# EAGLE design k1fm-pico-balloon (EAGLE 9.4.1)
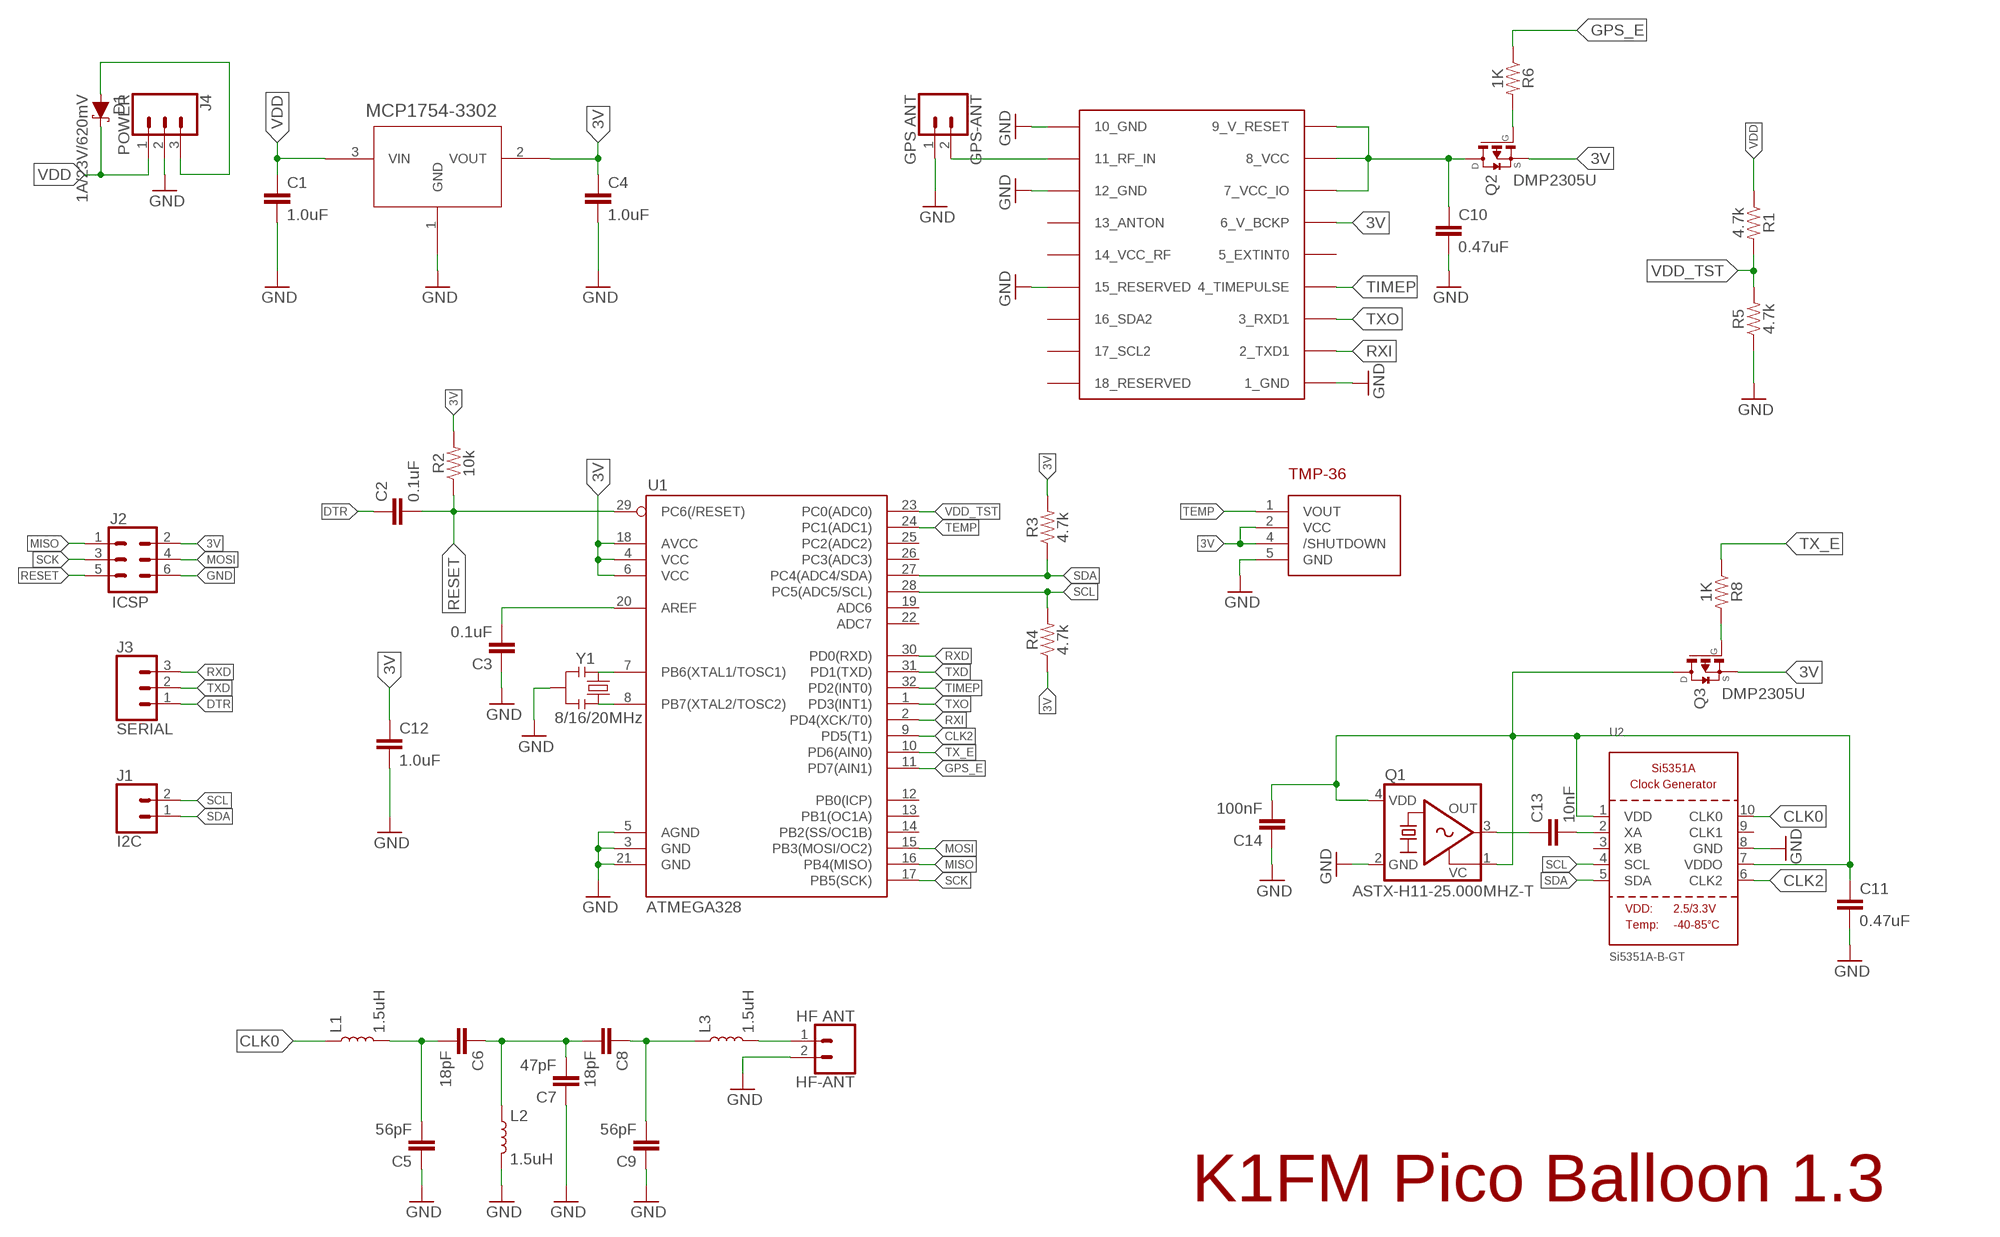
[diagram p0: schematic, sheet 1]

## Parts
C1  1.0uF  1.0UF-0603-16V-10%  [0603]
C2  0.1uF  0.1UF-0603-25V-5%  [0603]
C3  0.1uF  0.1UF-0603-25V-5%  [0603]
C4  1.0uF  1.0UF-0603-16V-10%  [0603]
C5  56pF  0.1UF-0603-25V-5%  [0603]
C6  18pF  0.1UF-0603-25V-5%  [0603]
C7  47pF  0.1UF-0603-25V-5%  [0603]
C8  18pF  0.1UF-0603-25V-5%  [0603]
C9  56pF  0.1UF-0603-25V-5%  [0603]
C10  0.47uF  0.1UF-0603-25V-5%  [0603]
C11  0.47uF  0.1UF-0603-25V-5%  [0603]
C12  1.0uF  1.0UF-0603-16V-10%  [0603]
C13  10nF  10NF-0603-50V-10%  [0603]
C14  100nF  10NF-0603-50V-10%  [0603]
D1  1A/23V/620mV  DIODE-SCHOTTKY-BAT20J  [SOD-323]
GPS1  UBLOX_MAX  [UBLOX_MAX]
GPS-ANT  GPS ANT  CONN_02  [1X02]
HF-ANT  HF ANT  CONN_02  [1X02]
J1  I2C  CONN_02  [1X02]
J2  ICSP  CONN_03X2FEMALE  [2X3]
J3  SERIAL  CONN_03  [1X03]
J4  POWER  CONN_03  [1X03]
L1  1.5uH  INDUCTOR-0603-33NH  [0603]
L2  1.5uH  INDUCTOR-0603-33NH  [0603]
L3  1.5uH  INDUCTOR-0603-33NH  [0603]
Q1  ASTX-H11-25.000MHZ-T  KXO-VCXO-SINE-84  [3.2X2.5_KXO-84]
Q2  DMP2305U  [SOT23]
Q3  DMP2305U  [SOT23]
R1  4.7k  10KOHM-0603-1/10W-1%  [0603]
R2  10k  10KOHM-0603-1/10W-1%  [0603]
R3  4.7k  4.7KOHM-0603-1/10W-1%  [0603]
R4  4.7k  4.7KOHM-0603-1/10W-1%  [0603]
R5  4.7k  10KOHM-0603-1/10W-1%  [0603]
R6  1K  10KOHM-0603-1/10W-1%  [0603]
R8  1K  10KOHM-0603-1/10W-1%  [0603]
U1  ATMEGA328  ATMEGA168  [TQFP32-08]
U2  Si5351A-B-GT  SI5351A  [MSOP10]
U3  MCP1754X-XXXXX/C  [SOT-23A_MC]
U4  TMP36  [SOT-23]
Y1  8/16/20MHz  RESONATOR1:1  [RESONATOR-SMD-1:1]

## Nets
3V: C4.1 C12.1 GPS1.6_V_BCKP J2.2 Q2.2(S) Q3.2(S) R2.2 R3.2 R4.1 U1.4(VCC) U1.6(VCC) U1.18(AVCC) U3.2(VOUT) U4.2(VCC) U4.4(/SHUTDOWN)
ANT: HF-ANT.1 L3.2
AREF: C3.2 U1.20(AREF)
CLK0: L1.1 U2.10(CLK0)
CLK2: U1.9(PD5(T1)) U2.6(CLK2)
DTR: C2.1 J3.1
GND: C1.2 C3.1 C4.2 C5.1 C7.1 C9.1 C10.2 C11.2 C12.2 C14.1 GPS1.1_GND GPS1.10_GND GPS1.12_GND GPS1.15_RESERVED GPS-ANT.1 HF-ANT.2 J2.6 J4.2 L2.2 Q1.2(GND) R5.1 U1.3(GND) U1.5(AGND) U1.21(GND) U2.8(GND) U3.1(GND) U4.5(GND) Y1.2
GPS_E: R6.1 U1.11(PD7(AIN1))
MISO: J2.1 U1.16(PB4(MISO))
MOSI: J2.4 U1.15(PB3(MOSI/OC2))
N$1: C13.1 Q1.3(OUT)
N$2: C13.2 U2.2(XA)
N$3: D1.A J4.3
N$5: Q2.1(G) R6.2
N$6: GPS1.11_RF_IN GPS-ANT.2
N$7: Q3.1(G) R8.2
N$8: C10.1 GPS1.7_VCC_IO GPS1.8_VCC GPS1.9_V_RESET Q2.3(D)
N$9: C6.1 C7.2 C8.2 L2.1
N$12: C5.2 C6.2 L1.2
N$13: C8.1 C9.2 L3.1
N$15: C11.1 C14.2 Q1.1(VC) Q1.4(VDD) Q3.3(D) U2.1(VDD) U2.7(VDDO)
N$28: U1.8(PB7(XTAL2/TOSC2)) Y1.3
N$29: U1.7(PB6(XTAL1/TOSC1)) Y1.1
RESET: C2.2 J2.5 R2.1 U1.29(PC6(/RESET))
RXD: J3.3 U1.30(PD0(RXD))
RXI: GPS1.2_TXD1 U1.2(PD4(XCK/T0))
SCK: J2.3 U1.17(PB5(SCK))
SCL: J1.2 R4.2 U1.28(PC5(ADC5/SCL)) U2.4(SCL)
SDA: J1.1 R3.1 U1.27(PC4(ADC4/SDA)) U2.5(SDA)
TEMP: U1.24(PC1(ADC1)) U4.1(VOUT)
TIMEP: GPS1.4_TIMEPULSE U1.32(PD2(INT0))
TX_E: R8.1 U1.10(PD6(AIN0))
TXD: J3.2 U1.31(PD1(TXD))
TXO: GPS1.3_RXD1 U1.1(PD3(INT1))
VDD: C1.1 D1.C J4.1 R1.1 U3.3(VIN)
VDD_TST: R1.2 R5.2 U1.23(PC0(ADC0))
Unconnected: GPS1.5_EXTINT0 GPS1.13_ANTON GPS1.14_VCC_RF GPS1.16_SDA2 GPS1.17_SCL2 GPS1.18_RESERVED U1.12(PB0(ICP)) U1.13(PB1(OC1A)) U1.14(PB2(SS/OC1B)) U1.19(ADC6) U1.22(ADC7) U1.25(PC2(ADC2)) U1.26(PC3(ADC3)) U2.3(XB) U2.9(CLK1)

## Notes on the sheet
- K1FM Pico Balloon 1.3

## Library data of the parts
C1 C4 C12 = SparkFun-Capacitors:1.0UF: 1µF ceramic capacitors A capacitor is a passive two-terminal electrical component used to store electrical energy temporarily in an electric field.; PROD_ID: CAP-00868
C2 C3 = SparkFun-Capacitors:0.1UF: 0.1µF ceramic capacitors A capacitor is a passive two-terminal electrical component used to store electrical energy temporarily in an electric field.; PROD_ID: CAP-08604
C5-C11 = SparkFun-Capacitors:0.1UF: 0.1µF ceramic capacitors A capacitor is a passive two-terminal electrical component used to store electrical energy temporarily in an electric field.; PROD_ID: CAP-08604; VALUE: 0.1uF
C13 = SparkFun-Capacitors:10NF: 0.01uF/10nF/10,000pF ceramic capacitors A capacitor is a passive two-terminal electrical component used to store electrical energy temporarily in an electric field. CAP-09321; PROD_ID: CAP-00867
C14 = SparkFun-Capacitors:10NF: 0.01uF/10nF/10,000pF ceramic capacitors A capacitor is a passive two-terminal electrical component used to store electrical energy temporarily in an electric field. CAP-09321; PROD_ID: CAP-00867; VALUE: 10nF
D1 = SparkFun-DiscreteSemi:DIODE-SCHOTTKY: Schottky diode A Schottky diode is a semiconductor diode which has a low forward voltage drop and a very fast switching action.; PROD_ID: DIO-11623
GPS1 = Ava:UBLOX_MAX: UBLOX MAX
GPS-ANT HF-ANT J1 = SparkFun-Connectors:CONN_02: Multi connection point. Often used as Generic Header-pin footprint for 0.1 inch spaced/style header connections On any of the 0.1 inch spaced packages, you can populate with these: Break Away Headers - Straight <https://www.sparkfun.com/products/116> (PRT-00116) Break Away Male Headers - Right Angle <https://www.sparkfun.com/products/553> (PRT-00553) Female Headers <https://www.sparkfun.com/products/115> (PRT-00115) Break Away Headers - Machine Pin <https://www.sparkfun.com/products/117> (PRT-00117) Break Away Female Headers - Swiss Machine Pin <https://www.sparkfun.com/products/743> (PRT-00743) For SCREWTERMINALS and SPRING TERMINALS visit here: Screw Terimnals on SparkFun.com <https://www.sparkfun.com/search/results?term=Screw+Terminals> (5mm/3.5mm/2.54mm spacing) This device is also useful as a general connection point to wire up your design to another part of your project. Our various solder wires solder well into these plated through hole pads. Hook-Up Wire - Assortment (Stranded, 22 AWG) <https://www.sparkfun.com/products/11375> (PRT-11375) Hook-Up Wire - Assortment (Solid Core, 22 AWG) <https://www.sparkfun.com/products/11367> (PRT-11367) View the entire wire category on our website here <https://www.sparkfun.com/categories/141> Special notes: Molex polarized connector foot print use with: PRT-08233 with associated crimp pins and housings. 2.54_SCREWTERM for use with PRT-10571. 3.5mm Screw Terminal footprints for PRT-08084 5mm Screw Terminal footprints for use with PRT-08432
J2 = SparkFun-Connectors:CONN_03X2: Multi connection point. Often used as Generic Header-pin footprint for 0.1 inch spaced/style header connections You can populate with any combo of single row headers, but if you'd like an exact match, check these: Header - 2x3 (Male, 0.1") <https://www.sparkfun.com/products/12807> (PRT-12807) Header - 2x3 (Female, 0.1") <https://www.sparkfun.com/products/13010> (PRT-13010) 2x3 Pin Shrouded Header <https://www.sparkfun.com/products/10877> (PRT-10877) On any of the 0.1 inch spaced packages, you can populate with these: Break Away Headers - Straight <https://www.sparkfun.com/products/116> (PRT-00116) Break Away Male Headers - Right Angle <https://www.sparkfun.com/products/553> (PRT-00553) Female Headers <https://www.sparkfun.com/products/115> (PRT-00115) Break Away Headers - Machine Pin <https://www.sparkfun.com/products/117> (PRT-00117) Break Away Female Headers - Swiss Machine Pin <https://www.sparkfun.com/products/743> (PRT-00743) Special note: the shrouded connector mates well with our 3x2 ribbon cables: Ribbon Crimp Connector - 6-pin (2x3, Female) <https://www.sparkfun.com/products/10651> (PRT-10651) Ribbon Cable - 6 wire (15ft) <https://www.sparkfun.com/products/10646> (PRT-10646); PROD_ID: CONN-11566; VALUE: FEMALE 2x3
J3 J4 = SparkFun-Connectors:CONN_03: Multi connection point. Often used as Generic Header-pin footprint for 0.1 inch spaced/style header connections On any of the 0.1 inch spaced packages, you can populate with these: Break Away Headers - Straight <https://www.sparkfun.com/products/116> (PRT-00116) Break Away Male Headers - Right Angle <https://www.sparkfun.com/products/553> (PRT-00553) Female Headers <https://www.sparkfun.com/products/115> (PRT-00115) Break Away Headers - Machine Pin <https://www.sparkfun.com/products/117> (PRT-00117) Break Away Female Headers - Swiss Machine Pin <https://www.sparkfun.com/products/743> (PRT-00743) Stackable Header - 3 Pin (Female, 0.1") <https://www.sparkfun.com/products/13875> (PRT-13875) For SCREWTERMINALS and SPRING TERMINALS visit here: Screw Terimnals on SparkFun.com <https://www.sparkfun.com/search/results?term=Screw+Terminals> (5mm/3.5mm/2.54mm spacing) This device is also useful as a general connection point to wire up your design to another part of your project. Our various solder wires solder well into these plated through hole pads. Hook-Up Wire - Assortment (Stranded, 22 AWG) <https://www.sparkfun.com/products/11375> (PRT-11375) Hook-Up Wire - Assortment (Solid Core, 22 AWG) <https://www.sparkfun.com/products/11367> (PRT-11367) View the entire wire category on our website here <https://www.sparkfun.com/categories/141> Special notes: Molex polarized connector foot print use with SKU : PRT-08232 with associated crimp pins and housings.
L1-L3 = SparkFun-Coils:INDUCTOR: Inductors Resist changes in electrical current. Basically a coil of wire. SparkFun Products: SparkFun Load Cell Amplifier - HX711 <https://www.sparkfun.com/products/13879> IOIO-OTG - V2.2 <https://www.sparkfun.com/products/13613>; PROD_ID: NDUC-07874; VALUE: 33nH/±5%/500mA
Q1 = crystal-geyer_V1_0:KXO-VCXO-SINE: VCXO : Sinewave - Serie Model Size l/w/h [mm] Frequency Range Frequency Stability Temp. Range [°C] Output AECQ 200 availabel Datasheet KXO-81 KXO-86 KXO-84 KXO-83 KXO-82 2.0/1.6/0.7 2.5/2.0/0.7 3.2/2.5/1.0 5.0/3.2/1.5 7.0/5.0/2.0 13,0 ~ 40,0 MHz 13,0 ~ 40,0 MHz 10,0 ~ 26,0 MHz 12,0 ~ 26,0 MHz 12,6 ~ 20,0 MHz ±10 … ±50ppm ±10 … ±50ppm ±10 … ±50ppm ±10 … ±50ppm ±10 … ±50ppm (*) -30°C …+75°C (*) -30°C …+75°C (*) -40°C …+85°C (*) -40°C …+85°C (*) -30°C …+80°C Sinewave Sinewave Sinewave Sinewave Sinewave - - - - - KXO-81.pdf <http://www.geyer-electronic.de/uploads/tx_userartikelfrequenz/GEYER-KXO-81-VCXO-sinewave.pdf> KXO-86.pdf <http://www.geyer-electronic.de/uploads/tx_userartikelfrequenz/GEYER-KXO-86-VCXO-sinewave.pdf> KXO-84.pdf <http://www.geyer-electronic.de/uploads/tx_userartikelfrequenz/GEYER-KXO-84-VCXO-sinewave.pdf> KXO-83.pdf <http://www.geyer-electronic.de/uploads/tx_userartikelfrequenz/GEYER-KXO-83-VCXO-sinewave.pdf> KXO-82.pdf <http://www.geyer-electronic.de/uploads/tx_userartikelfrequenz/GEYER-KXO-82-VCXO-sinewave.pdf> <http://www.geyer-electronic.de/fileadmin/template/img/logo-geyer-electronic.png> Details see: http://www.geyer-electronic.de/Frequenz-Produkte.9.0.html Created 2016-06-07, Hans Locher 2016 (C) Geyer Quartz Technology KXO81,KXO86,KXO84,KXO83,KXO82,2,0x1,6;2.0x1.6;2,5x2,0;2.5x2.0;3,2x2,5;3.2x2.5;5,0x3,2;5.0x3.2;7,0x5,0;7.0x5.0;2016;2520;3225;5032;7050
Q2 Q3 = transistor-fet:DMP2305U: P-Channel Enhancement MOSFET
R1 R5 R6 R8 = SparkFun-Resistors:10KOHM: 10kΩ resistor A resistor is a passive two-terminal electrical component that implements electrical resistance as a circuit element. Resistors act to reduce current flow, and, at the same time, act to lower voltage levels within circuits. - Wikipedia; PROD_ID: RES-00824; VALUE: 10k
R2 = SparkFun-Resistors:10KOHM: 10kΩ resistor A resistor is a passive two-terminal electrical component that implements electrical resistance as a circuit element. Resistors act to reduce current flow, and, at the same time, act to lower voltage levels within circuits. - Wikipedia; PROD_ID: RES-00824
R3 R4 = SparkFun-Resistors:4.7KOHM: 4.7kΩ resistor A resistor is a passive two-terminal electrical component that implements electrical resistance as a circuit element. Resistors act to reduce current flow, and, at the same time, act to lower voltage levels within circuits. - Wikipedia; PROD_ID: RES-07857
U1 = SparkFun:ATMEGA168
U2 = microbuilder:SI5351A: Si5351A 8kHz-160MHz I2C Clock Generator VDD: 2.5V or 3.3V Input Range: 25MHz or 27MHz XTAL User selectable internal input load capacitors: 6, 8 or 10 pF Output Impedance: 85 Ohm Output Load Capacitance: 5-15pF Operating Temperature: -40°C - 85°C Operating Current (3 outputs): 35mA Output buffer voltage (VDDO): 1.8, 2.5 or 3.3V Note: If VDDO is not used it should be connected to VDD. Unused clock out pins should be left floating.
U3 = MCP1754:MCP1754X-XXXXX/C
U4 = TMP36:TMP36
Y1 = Testing:RESONATOR: Resonator Small SMD resonator. This is the itty bitty 10/20MHz resonators with built in caps. CSTCE10M0G55 and CSTCE20M0V53. Footprint for SMD has been used in SFE production for years, and does work okay. 1:1 is an attempt to get larger fillets on the sides so it will be easier to inspect these solders in our AOI machine. The pads have been minimized to match the actual metal under the resonator. To see this relation, it includes an image import of the bottom side of the component. Imported to scale on layer 200.

## Net classes
1 vcc: width 0.254 mm

## Board
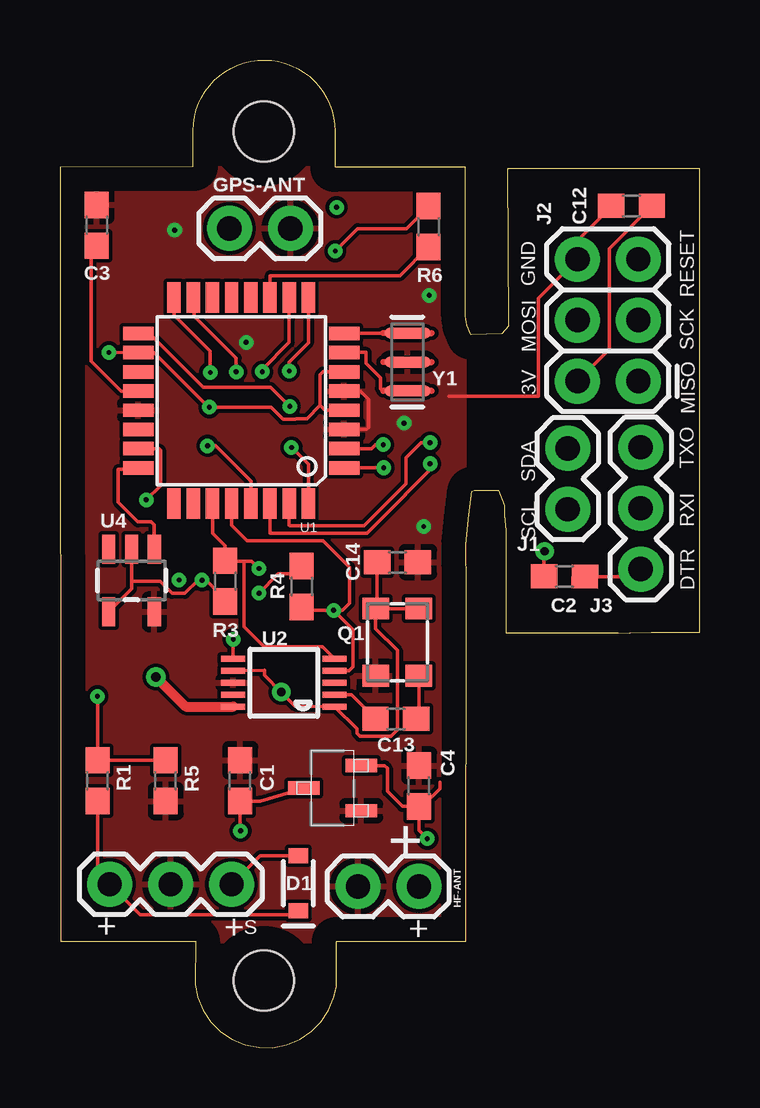
[diagram p1: board, top side]
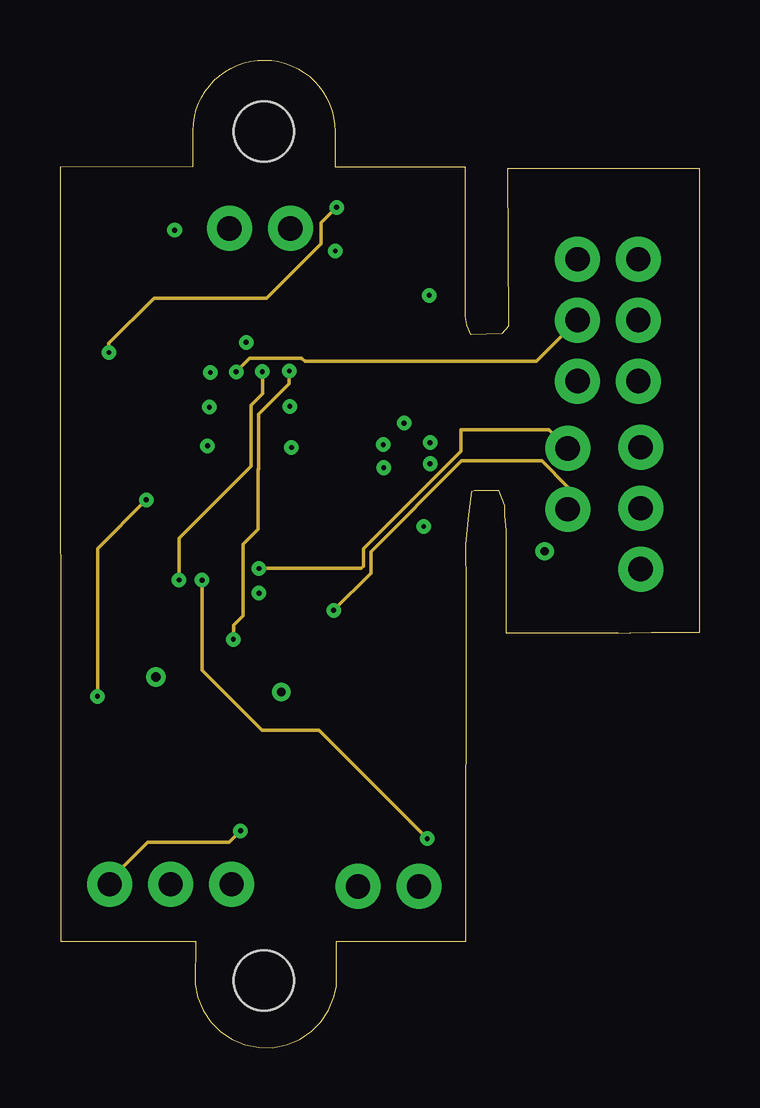
[diagram p2: board, inner layer Route2]
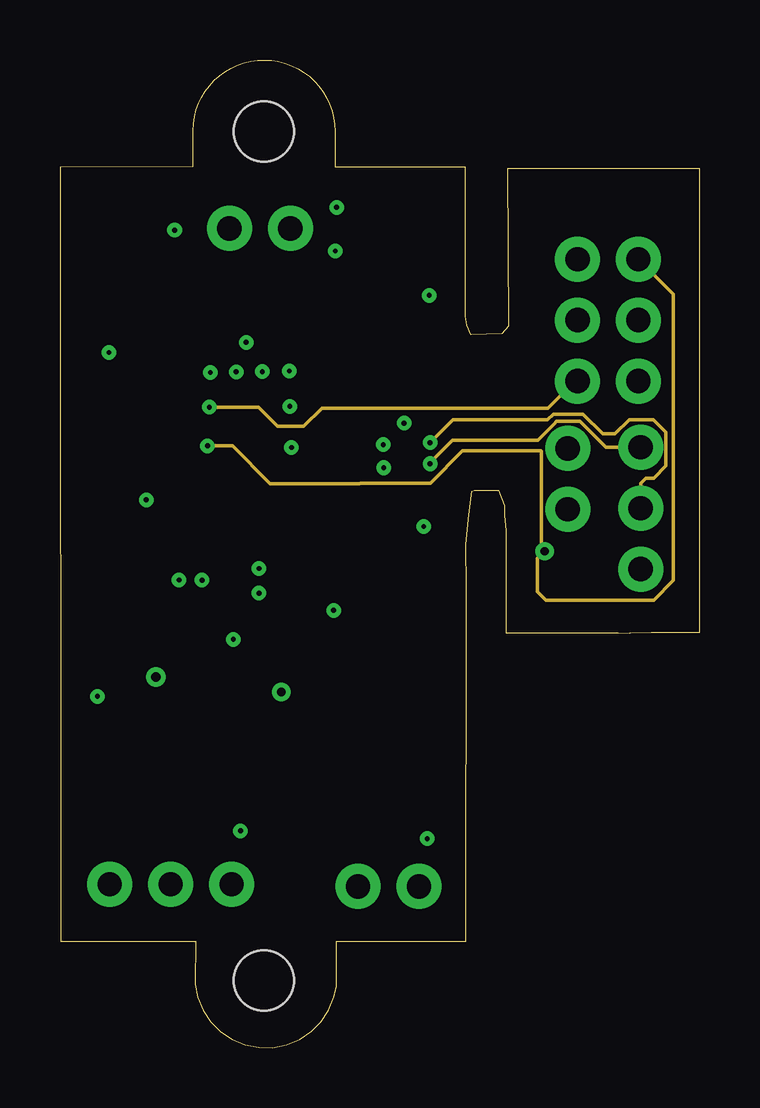
[diagram p3: board, inner layer Route15]
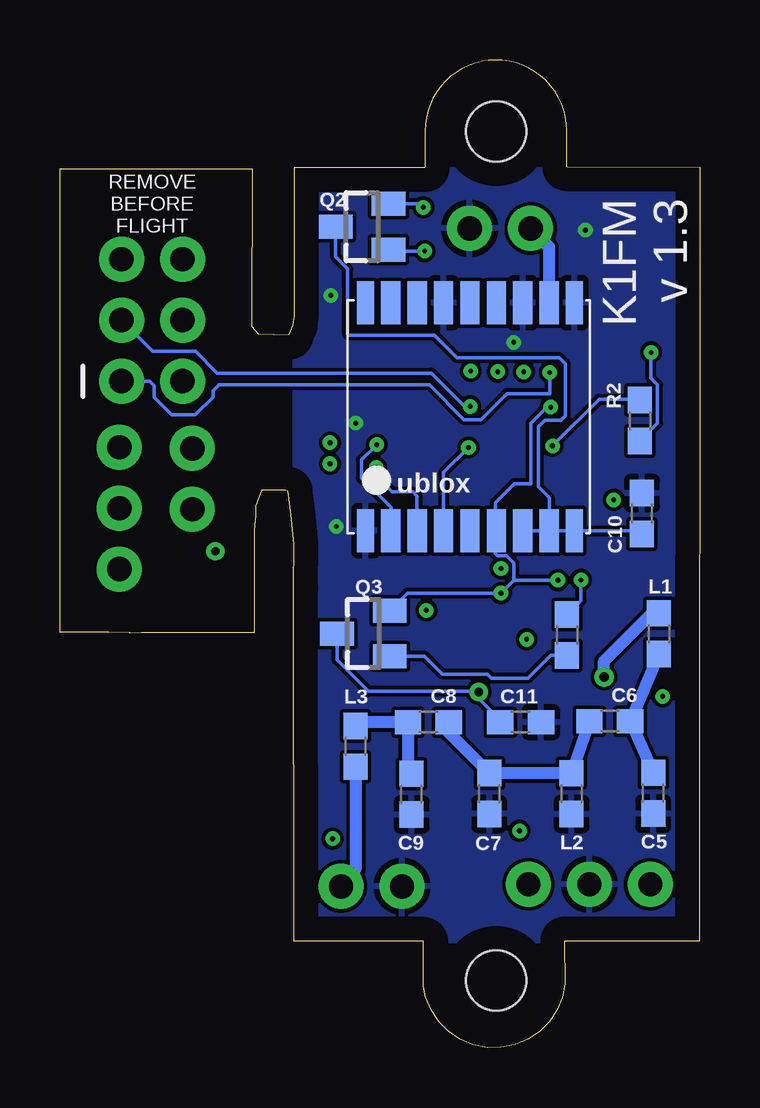
[diagram p4: board, bottom side, seen from below]

Size 26.69 x 41.15 mm. Coordinates in mm from the lower left corner, seen from the top.
Outline: 0.02,4.43 5.65,4.44 5.64,2.62 5.75,2.1 5.97,1.56 6.29,1.08 6.71,0.66 7.18,0.34 7.72,0.12 8.3,0 8.87,0 9.46,0.12 10,0.34 10.49,0.67 10.88,1.06 11.21,1.55 11.44,2.11 11.53,2.56 11.53,4.42 16.93,4.43 16.94,19.15 16.93,20.95 17.03,22 17.08,22.37 17.17,23.17 17.29,23.22 18.28,23.23 18.54,22.58 18.54,22.46 18.53,22.18 18.6,21.54 18.6,21.52 18.59,17.28 21.69,17.28 23.29,17.27 23.77,17.27 23.78,17.28 24.66,17.29 24.72,17.3 26.64,17.3 26.69,17.3 26.68,36.62 18.67,36.61 18.69,30.05 18.43,29.73 17.13,29.7 16.96,30.1 16.91,30.48 16.91,36.67 11.46,36.67 11.46,38.17 arc180 5.55,38.21 5.55,36.71 0,36.67 0.02,4.43
Copper layers (1+2*15+16): Top 0.035mm / dielectric 0.15mm / Route2 0.035mm / dielectric 0.15mm / Route15 0.035mm / dielectric 0.2mm / Bottom 0.035mm
Design rules "default *": minimum track width 6mil, minimum drill 0.1mm, track to track 6mil, track to pad 6mil, pad to pad 6mil, via to via 6mil, smd to smd 6mil, copper to edge 40mil, drill to drill 6mil, minimum pad ring 10mil, minimum via ring 8mil, stop-mask expansion 4mil, vias tented up to drill 0mil, thermal gap 10mil
Holes 2.5 mm at 8.5,38.17 8.5,2.79

### Footprints (pad centres in the part's own frame; a part is rotated, then mirrored left to right if it is on the bottom)
0603 = smd 1.1 x 1: 1 -0.85,0; 2 0.85,0
SOD-323 = smd 0.63 x 0.83: A 1.15,0; C -1.15,0
UBLOX_MAX = smd 1.8 x 0.7: 1_GND 4.95,-4.4; 9_V_RESET 4.95,4.3; 10_GND -4.55,4.3; 18_RESERVED -4.55,-4.4 | smd 1.8 x 0.8: 2_TXD1 4.95,-3.35; 3_RXD1 4.95,-2.25; 4_TIMEPULSE 4.95,-1.15; 5_EXTINT0 4.95,-0.05; 6_V_BCKP 4.95,1.05; 7_VCC_IO 4.95,2.15; 8_VCC 4.95,3.25; 11_RF_IN -4.55,3.25; 12_GND -4.55,2.15; 13_ANTON -4.55,1.05; 14_VCC_RF -4.55,-0.05; 15_RESERVED -4.55,-1.15; 16_SDA2 -4.55,-2.25; 17_SCL2 -4.55,-3.35
1X02 = drill 1.016 pad 1.88: 1 0,0; 2 2.54,0
2X3 = drill 1.016 pad 1.88: 1 0,0; 2 0,2.54; 3 2.54,0; 4 2.54,2.54; 5 5.08,0; 6 5.08,2.54
1X03 = drill 1.016 pad 1.88: 1 0,0; 2 2.54,0; 3 5.08,0
3.2X2.5_KXO-84 = smd 0.9 x 1.1: 1 -1.4,-0.9; 2 1.4,-0.9; 3 1.4,0.9; 4 -1.4,0.9
SOT23 = smd 1 x 1.4: 1 -0.95,-1.1; 2 0.95,-1.1; 3 0,1.1
TQFP32-08 = smd 1.27 x 0.559: 1 -4.293,2.8; 2 -4.293,2; 3 -4.293,1.2; 4 -4.293,0.4; 5 -4.293,-0.4; 6 -4.293,-1.2; 7 -4.293,-2; 8 -4.293,-2.8; 17 4.293,-2.8; 18 4.293,-2; 19 4.293,-1.2; 20 4.293,-0.4; 21 4.293,0.4; 22 4.293,1.2; 23 4.293,2; 24 4.293,2.8 | smd 0.559 x 1.27: 9 -2.8,-4.293; 10 -2,-4.293; 11 -1.2,-4.293; 12 -0.4,-4.293; 13 0.4,-4.293; 14 1.2,-4.293; 15 2,-4.293; 16 2.8,-4.293; 25 2.8,4.293; 26 2,4.293; 27 1.2,4.293; 28 0.4,4.293; 29 -0.4,4.293; 30 -1.2,4.293; 31 -2,4.293; 32 -2.8,4.293
MSOP10 = smd 0.25 x 1: 1 -1,-2.113; 2 -0.5,-2.113; 3 0,-2.113; 4 0.5,-2.113; 5 1,-2.113; 6 1,2.113; 7 0.5,2.113; 8 0,2.113; 9 -0.5,2.113; 10 -1,2.113
SOT-23A_MC = smd 0.559 x 1.321: 1 -0.94,-1.194; 2 0.94,-1.194; 3 0,1.194
SOT-23 = smd 0.55 x 1.2: 1 -0.95,-1.3; 2 0,-1.3; 3 0.95,-1.3; 4 0.95,1.3; 5 -0.95,1.3
RESONATOR-SMD-1:1 = smd 0.45 x 1.905: 1 -1.2,0; 2 0,0; 3 1.2,0

### Placement (x,y rotation side)
C1  7.51,11.12 90 top
C2  21.03,19.63 179.6 top
C3  1.53,34.26 270 top
C4  14.97,10.9 90 top
C5  1.95,10.6 90 bottom
C6  3.76,13.59 0 bottom
C7  8.78,10.58 90 bottom
C8  11.33,13.55 0 bottom
C9  12.03,10.56 90 bottom
C10  2.42,22.25 90 bottom
C11  7.48,13.56 0 bottom
C12  23.83,35.07 180 top
C13  14,13.7 180 top
C14  14.07,20.22 180 top
D1  9.94,6.84 90 top
GPS1  9.54,26.48 270 bottom
GPS-ANT  9.61,34.13 180 top
HF-ANT  14.97,6.72 180 top
J1  21.17,24.97 270 top
J2  24.12,27.77 90 top
J3  24.21,19.93 90 top
J4  2.07,6.8 0 top
L1  1.71,17.24 270 bottom
L2  5.36,10.58 270 bottom
L3  14.37,12.55 270 bottom
Q1  14.06,16.89 270 top
Q2  14.09,34.2 90 bottom
Q3  14.04,17.25 90 bottom
R1  1.56,11.12 90 top
R2  2.5,26.12 270 bottom
R3  6.89,19.43 270 top
R4  10.08,19.21 270 top
R5  1k  [0603]  4.41,11.12 90 top
R6  15.37,34.21 90 top
R8  5.55,17.19 270 bottom
U1  7.56,26.95 180 top
U2  9.33,15.2 90 top
U3  11.37,10.81 90 top
U4  2.99,19.46 180 top
Y1  14.49,28.56 90 top

### Tracks (layer width: path | path; a pad name or v marks a point on that pad's centre or on a via)
3V  (via drill 0.2)
  Top 0.152: 10.85,26.75 10.85,28.04 10.96,28.15 U1.6 | 10.85,26.75 11.05,26.55 U1.4 | U4.2 | v2.04,28.96 U1.18 3.92,28.95 6.19,26.68 v6.23,26.68 8.8,26.68 9.3,26.18 9.81,26.18 9.84,26.2 10.3,26.2 10.85,26.75 | U3.2 13.53,11.75 13.65,11.63 13.65,10.68 14.28,10.05 C4.1 | C4.1 14.97,9.04 v15.32,8.7 | 15.84,11.05 15.84,10.79 15.1,10.05 C4.1 | R4.1 9.75,19.73 9.1,19.73 v8.3,18.93 | U4.4 2.99,19.11 2.99,19.41 | 2.99,19.41 U4.2 | C12.1 22.9,33.29 22.9,29.09 J2.2 | R3.2 6.89,18.68 6.1,19.48 v5.92,19.48 5.76,19.48 5.21,18.92 4.67,18.92 4.17,19.42 3,19.42 2.99,19.41
  Route2 0.152: v2.04,28.96 2.04,29.34 3.93,31.22 8.62,31.22 10.89,33.5 10.89,34.36 v11.54,35.01 | v15.32,8.7 10.81,13.21 8.43,13.21 5.92,15.71 v5.92,19.48
  Route15 0.152: v6.23,26.68 8.27,26.68 9.07,25.89 10.16,25.89 10.92,26.65 20.35,26.65 21.47,27.77 J2.2
  Bottom 0.152: v5.92,19.48 7.77,19.48 | 8.53,21.58 8.53,22.7 7.74,23.49 7.06,23.49 7.06,26.01 6.38,26.68 v6.23,26.68 | 8.53,21.58 GPS1.6_V_BCKP | 7.77,19.48 7.77,20.18 8.08,20.49 8.46,20.49 8.53,20.57 8.53,21.58 | v2.04,28.96 2.04,27.89 1.77,27.62 1.77,26 R2.2 | Q3.2 12.2,18.93 v8.3,18.93 7.77,19.48 | v11.54,35.01 11.68,35.15 Q2.2
ANT
  Bottom 0.254: 14.35,11.68 L3.2
  Bottom 0.508: 14.35,11.68 14.35,7.45 HF-ANT.1
AREF
  Top 0.152: U1.20 2.54,27.35 1.3,28.59 1.3,33.18 C3.2
CLK0  (via drill 0.4)
  Top 0.406: v4,15.44 5.24,14.2 U2.10
  Bottom 0.152: L1.1 2.01,18.09
  Bottom 0.508: v4,15.44 4,16.1 2.01,18.09
CLK2  (via drill 0.2)
  Top 0.152: U2.6 v7.22,17 v7.23,17.01 | U1.9 10.36,29.36 9.56,28.56 v9.56,28.19
  Route2 0.152: v7.23,17.01 7.23,17.59 7.63,17.99 7.63,18.68 7.63,20.96 8.27,21.6 8.27,24.09 8.28,24.1 8.28,26.38 9.56,27.66 v9.56,28.19
DTR
  Top 0.152: C2.1 23.91,19.62 J3.1
GND  (via drill 0.2)
  Top 0.152: C12.2 22.98,35.02 21.58,33.62 J2.6 19.95,31.22 19.95,27.13 16.22,27.13 | U1.5 12.53,27.35 12.87,27.02 12.87,25.83 12.79,25.75 U1.3
  other vias: 15.17,21.71 7.77,29.38 4.78,34.06 15.4,31.34 14.35,26.01
  pour Top: 0,36.65 16.89,36.65 16.89,36.65 16.89,4.43 16.93,4.47 16.93,4.41 0.04,4.41 0.02,4.43
  pour Bottom: -0.02,36.62 16.93,36.62 16.93,4.42 16.94,4.41 0.05,4.41 0,4.46
GPS_E
  Top 0.152: U1.11 8.76,32.16 14.18,32.16 R6.1
MISO  (via drill 0.2)
  Top 0.152: v6.27,28.12 6.27,29.01 4.76,30.52 U1.16
  Bottom 0.152: J2.1 22.95,27.77 22.75,27.56 22.75,27.09 22.02,26.36 21.04,26.36 20.3,27.09 20.3,27.36 20.06,27.61 11.28,27.61 9.84,26.16 9.14,26.16 8.05,27.25 6.27,27.25 v6.27,28.12
MOSI  (via drill 0.2)
  Top 0.152: v7.35,28.16 7.35,28.72 5.6,30.47 5.6,31.2 U1.15
  Route2 0.152: v7.35,28.16 7.92,28.72 10.08,28.72 10.21,28.59 19.86,28.59 J2.4
N$1
  Top 0.152: Q1.3 14.96,15.37 14.96,15.2 14.96,13.8 arc-90 C13.1
N$2
  Top 0.152: U2.2 12.15,14.7 C13.2
N$3
  Top 0.152: D1.A 8.34,7.99 J4.3
N$5  (via drill 0.2)
  Top 0.152: v11.48,33.18 12.42,34.12 14.44,34.12 R6.2
  Bottom 0.152: v11.48,33.18 12.93,33.18 Q2.1
N$6
  Bottom 0.508: GPS-ANT.2 6.29,33.35 GPS1.11_RF_IN
N$7
  Bottom 0.152: R8.2 6.22,16.34 7.17,15.39 8.7,15.39 8.87,15.56 10.74,15.56 11.48,16.3 Q3.1
N$8
  Bottom 0.152: GPS1.7_VCC_IO GPS1.8_VCC | GPS1.8_VCC GPS1.9_V_RESET 2.55,21.53 C10.1 | GPS1.8_VCC 6.29,22.91 6.74,23.36 6.74,25.87 6.46,26.14 5.8,26.14 5.62,26.32 5.62,28.5 5.87,28.75 10.14,28.75 11.08,29.68 14.66,29.68 14.69,29.72 14.69,32.44 15.19,32.94 Q2.3
N$9
  Bottom 0.152: 10.47,13.12 C8.2 | C7.2
  Bottom 0.508: C7.2 10.47,13.12 | C7.2 L2.1 C6.1
N$12
  Bottom 0.508: C5.2 C6.2 L1.2
N$13
  Bottom 0.152: C9.2 12.18,11.55 | 14.22,13.55 L3.1
  Bottom 0.508: 12.18,11.55 C8.1 14.22,13.55
N$15  (via drill 0.35)
  Top 0.152: U2.7 8.54,15.72 8.54,15.5 v9.23,14.81 9.81,14.23 U2.1 12.38,13.27 12.38,13.1 12.51,12.97 13.8,12.97 14.07,13.24 14.07,16.55 13.16,17.45 Q1.1 | Q1.4 Q1.1 | Q1.1 13.22,18.35 C14.2
  Bottom 0.152: C11.1 8.72,13.95 8.72,14.03 9.23,14.53 v9.23,14.81 9.25,14.83 13.81,14.83 15.14,16.16 Q3.3
N$28
  Top 0.152: U1.8 Y1.3
N$29
  Top 0.152: Y1.1 13.46,27.35 13.36,27.45 13.36,27.91 12.76,28.5 12.76,28.96 U1.7
RESET  (via drill 0.2, 0.35)
  Top 0.152: C2.2 20.18,20.66 v20.21,20.68 | v6.15,25.07 6.48,25.07 7.97,23.58 U1.29
  Route15 0.152: J2.5 25.58,31.39 25.58,19.47 24.75,18.64 20.26,18.64 19.91,19 19.91,20.38 v20.21,20.68 20.07,20.81 20.07,24.84 20.05,24.86 16.78,24.86 15.44,23.52 12.53,23.52 12.5,23.49 8.77,23.49 7.19,25.07 v6.15,25.07
  Bottom 0.152: R2.1 2.55,27.02 4.2,27.02 v6.15,25.07
RXD  (via drill 0.2)
  Top 0.152: v15.43,24.32 15.43,24.06 14.39,23.03 14.4,23.03 12.81,21.43 8.76,21.43 U1.30
  Route15 0.152: v15.43,24.32 15.43,24.37 16.37,25.31 19.92,25.31 20.6,26 20.7,26.09 21.68,26.09 22.77,25.01 J3.3
RXI  (via drill 0.2)
  Top 0.152: U1.2 13,24.95 13.16,25.12 v13.48,25.12
  Bottom 0.152: v13.48,25.12 14.11,24.48 14.11,23.73 12.89,22.5 GPS1.2_TXD1
SCK  (via drill 0.2)
  Top 0.152: U1.17 3.72,29.75 5.97,27.51 8.79,27.51 v9.58,26.72
  Bottom 0.152: J2.3 22.81,29 21.03,29 20.13,28.1 11.2,28.1 9.82,26.72 v9.58,26.72
SCL  (via drill 0.2)
  Top 0.152: U1.28 7.16,21.75 7.8,21.11 10.98,21.11 12.07,20.02 12.07,18.52 11.77,18.21 v11.41,18.21 | R4.2 10.22,18.21 v11.41,18.21 | v11.41,18.21 12.21,17.42 12.21,15.86 12.06,15.7 U2.4
  Route2 0.152: v11.41,18.21 12.96,19.76 12.96,20.66 16.74,24.44 20.09,24.44 21.17,23.35 J1.2
SDA  (via drill 0.2)
  Top 0.152: U1.27 6.36,21.44 6.89,20.9 R3.1 6.91,20.27 7.68,20.27 | 7.68,20.27 7.68,17.52 8.5,16.7 10.95,16.7 U2.5 | 7.68,20.27 8,20.27 v8.3,19.96
  Route2 0.152: v8.3,19.96 12.56,19.96 12.65,20.06 12.65,20.79 16.72,24.85 16.72,25.74 20.39,25.74 J1.1
TEMP
  Top 0.152: U4.1 3.94,21.77 3.81,21.91 3.25,21.91 2.44,22.71 2.44,24.09 3.2,24.09 U1.24
TIMEP  (via drill 0.2)
  Top 0.152: U1.32 10.36,24.3 v9.65,25
  Bottom 0.152: v9.65,25 10.69,23.96 GPS1.4_TIMEPULSE
TX_E  (via drill 0.2)
  Top 0.152: U1.10 9.56,29.38 8.44,28.26 v8.44,28.16
  Route2 0.152: v8.44,28.16 8.44,27.23 7.97,26.76 7.97,24.22 4.96,21.22 v4.96,19.48
  Bottom 0.152: R8.1 4.96,18.62 v4.96,19.48
TXD  (via drill 0.2)
  Top 0.152: U1.31 9.56,21.77 9.59,21.74 12.67,21.74 14.43,23.5 14.43,24.57 15.06,25.2 v15.43,25.2
  Route15 0.152: J3.2 24.21,23.51 24.42,23.72 24.76,23.72 25.27,24.23 25.27,25.64 24.74,26.17 23.74,26.17 23.14,25.57 22.64,25.57 21.81,26.4 20.57,26.4 20.33,26.16 16.38,26.16 v15.43,25.2
TXO  (via drill 0.2)
  Top 0.152: U1.1 v13.49,24.15 v13.5,24.16
  Bottom 0.152: v13.5,24.16 13.5,23.79 12.85,23.15 11.97,23.15 11.79,22.97 GPS1.3_RXD1
VDD  (via drill 0.2)
  Top 0.152: U3.3 8.34,10.27 C1.1 7.51,9.04 v7.53,9.03 | R1.1 1.56,7.31 J4.1 3.35,5.53 9.78,5.53 D1.C
  Route2 0.152: v7.53,9.03 7.04,8.54 3.65,8.54 2.07,6.96 J4.1
VDD_TST  (via drill 0.2)
  Top 0.152: R5.2 R1.2 v1.56,14.63 | U1.23 4.13,24.95 4.19,24.89 4.19,23.41 v3.6,22.82
  Route2 0.152: v3.6,22.82 1.56,20.78 v1.56,14.63

### Text on the board
tPlace: RESET | GND | MOSI | SCK | MISO | 3V | SDA | TXO | RXI | SCL | DTR | S
tNames: + | + | + | +
bNames: K1FM / v 1.3 | REMOVE / BEFORE / FLIGHT